# Altium schematic sheet testboard_chip1.SchDoc
size E
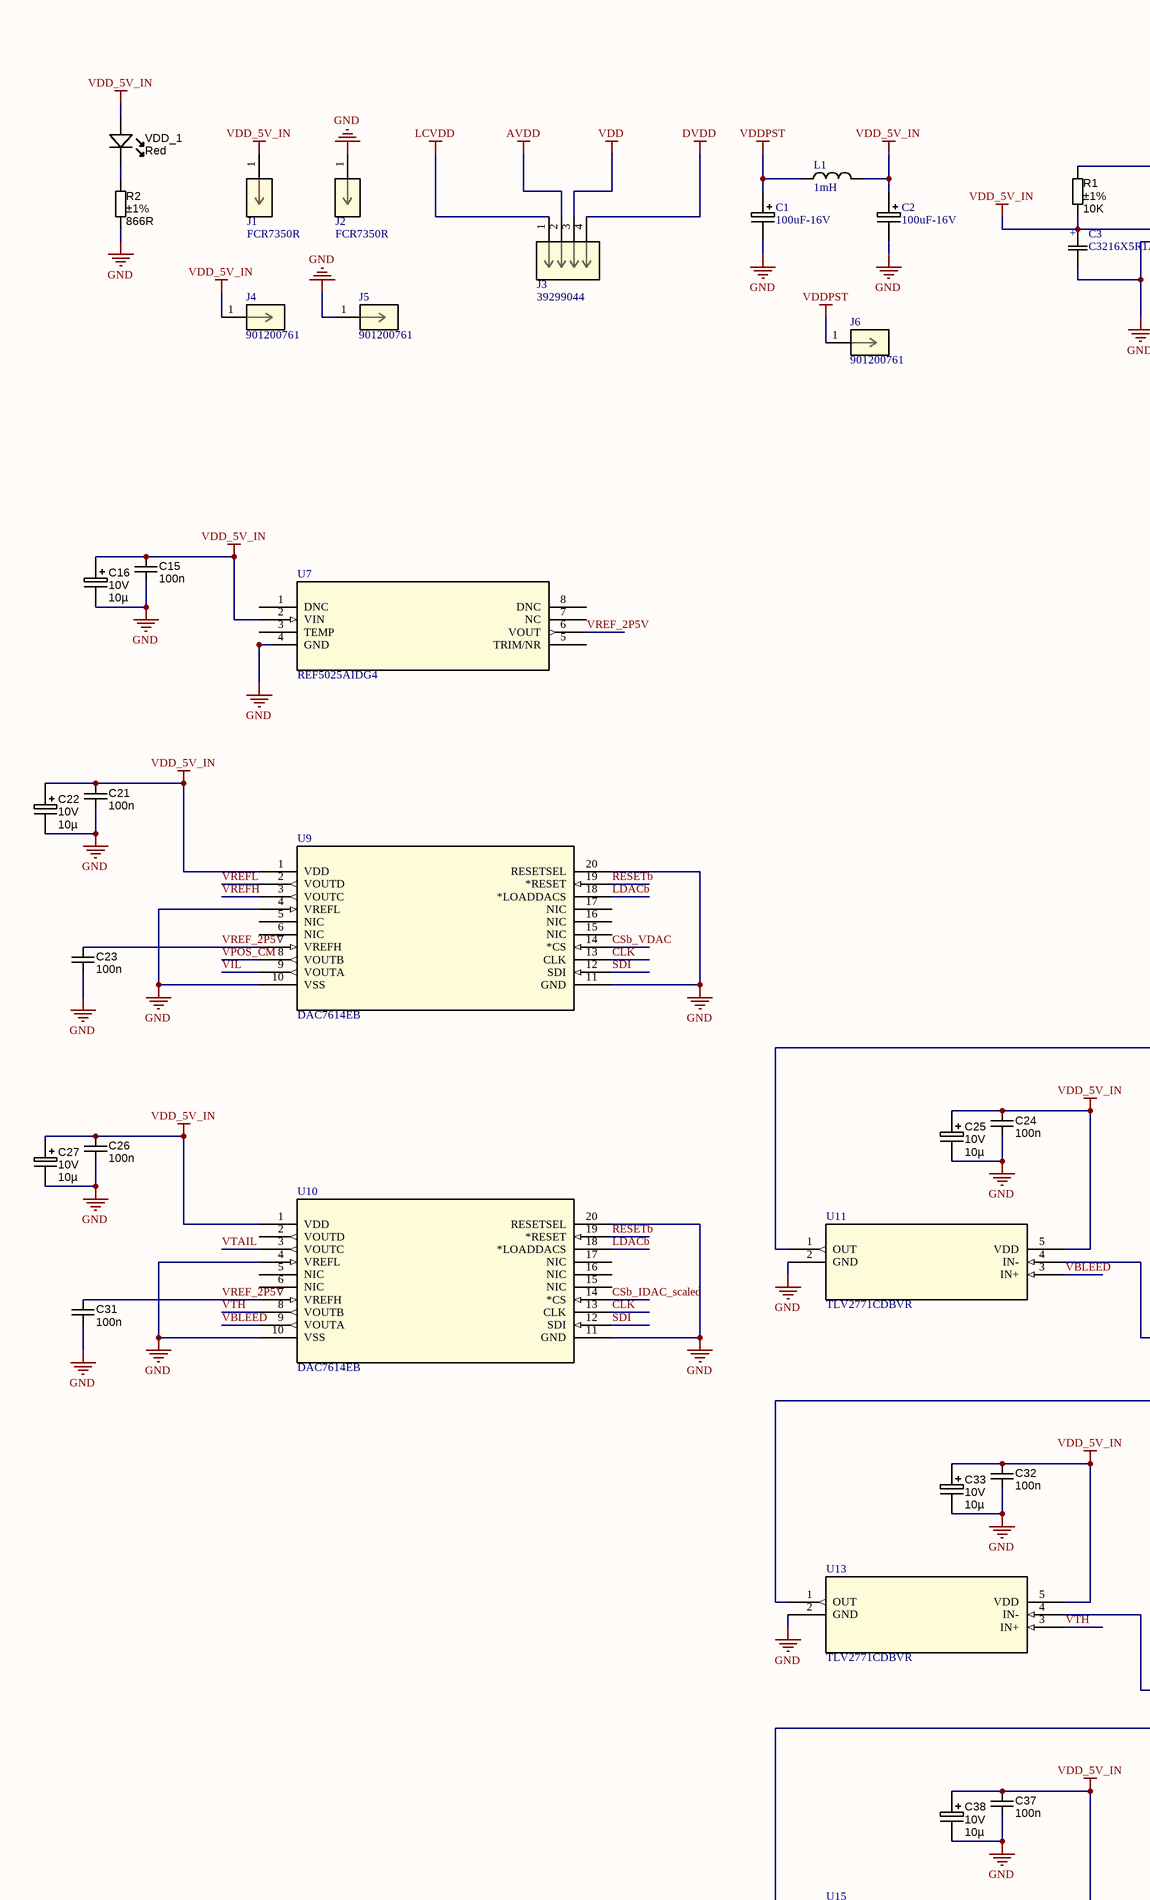
[diagram p0: testboard_chip1.SchDoc, top left]
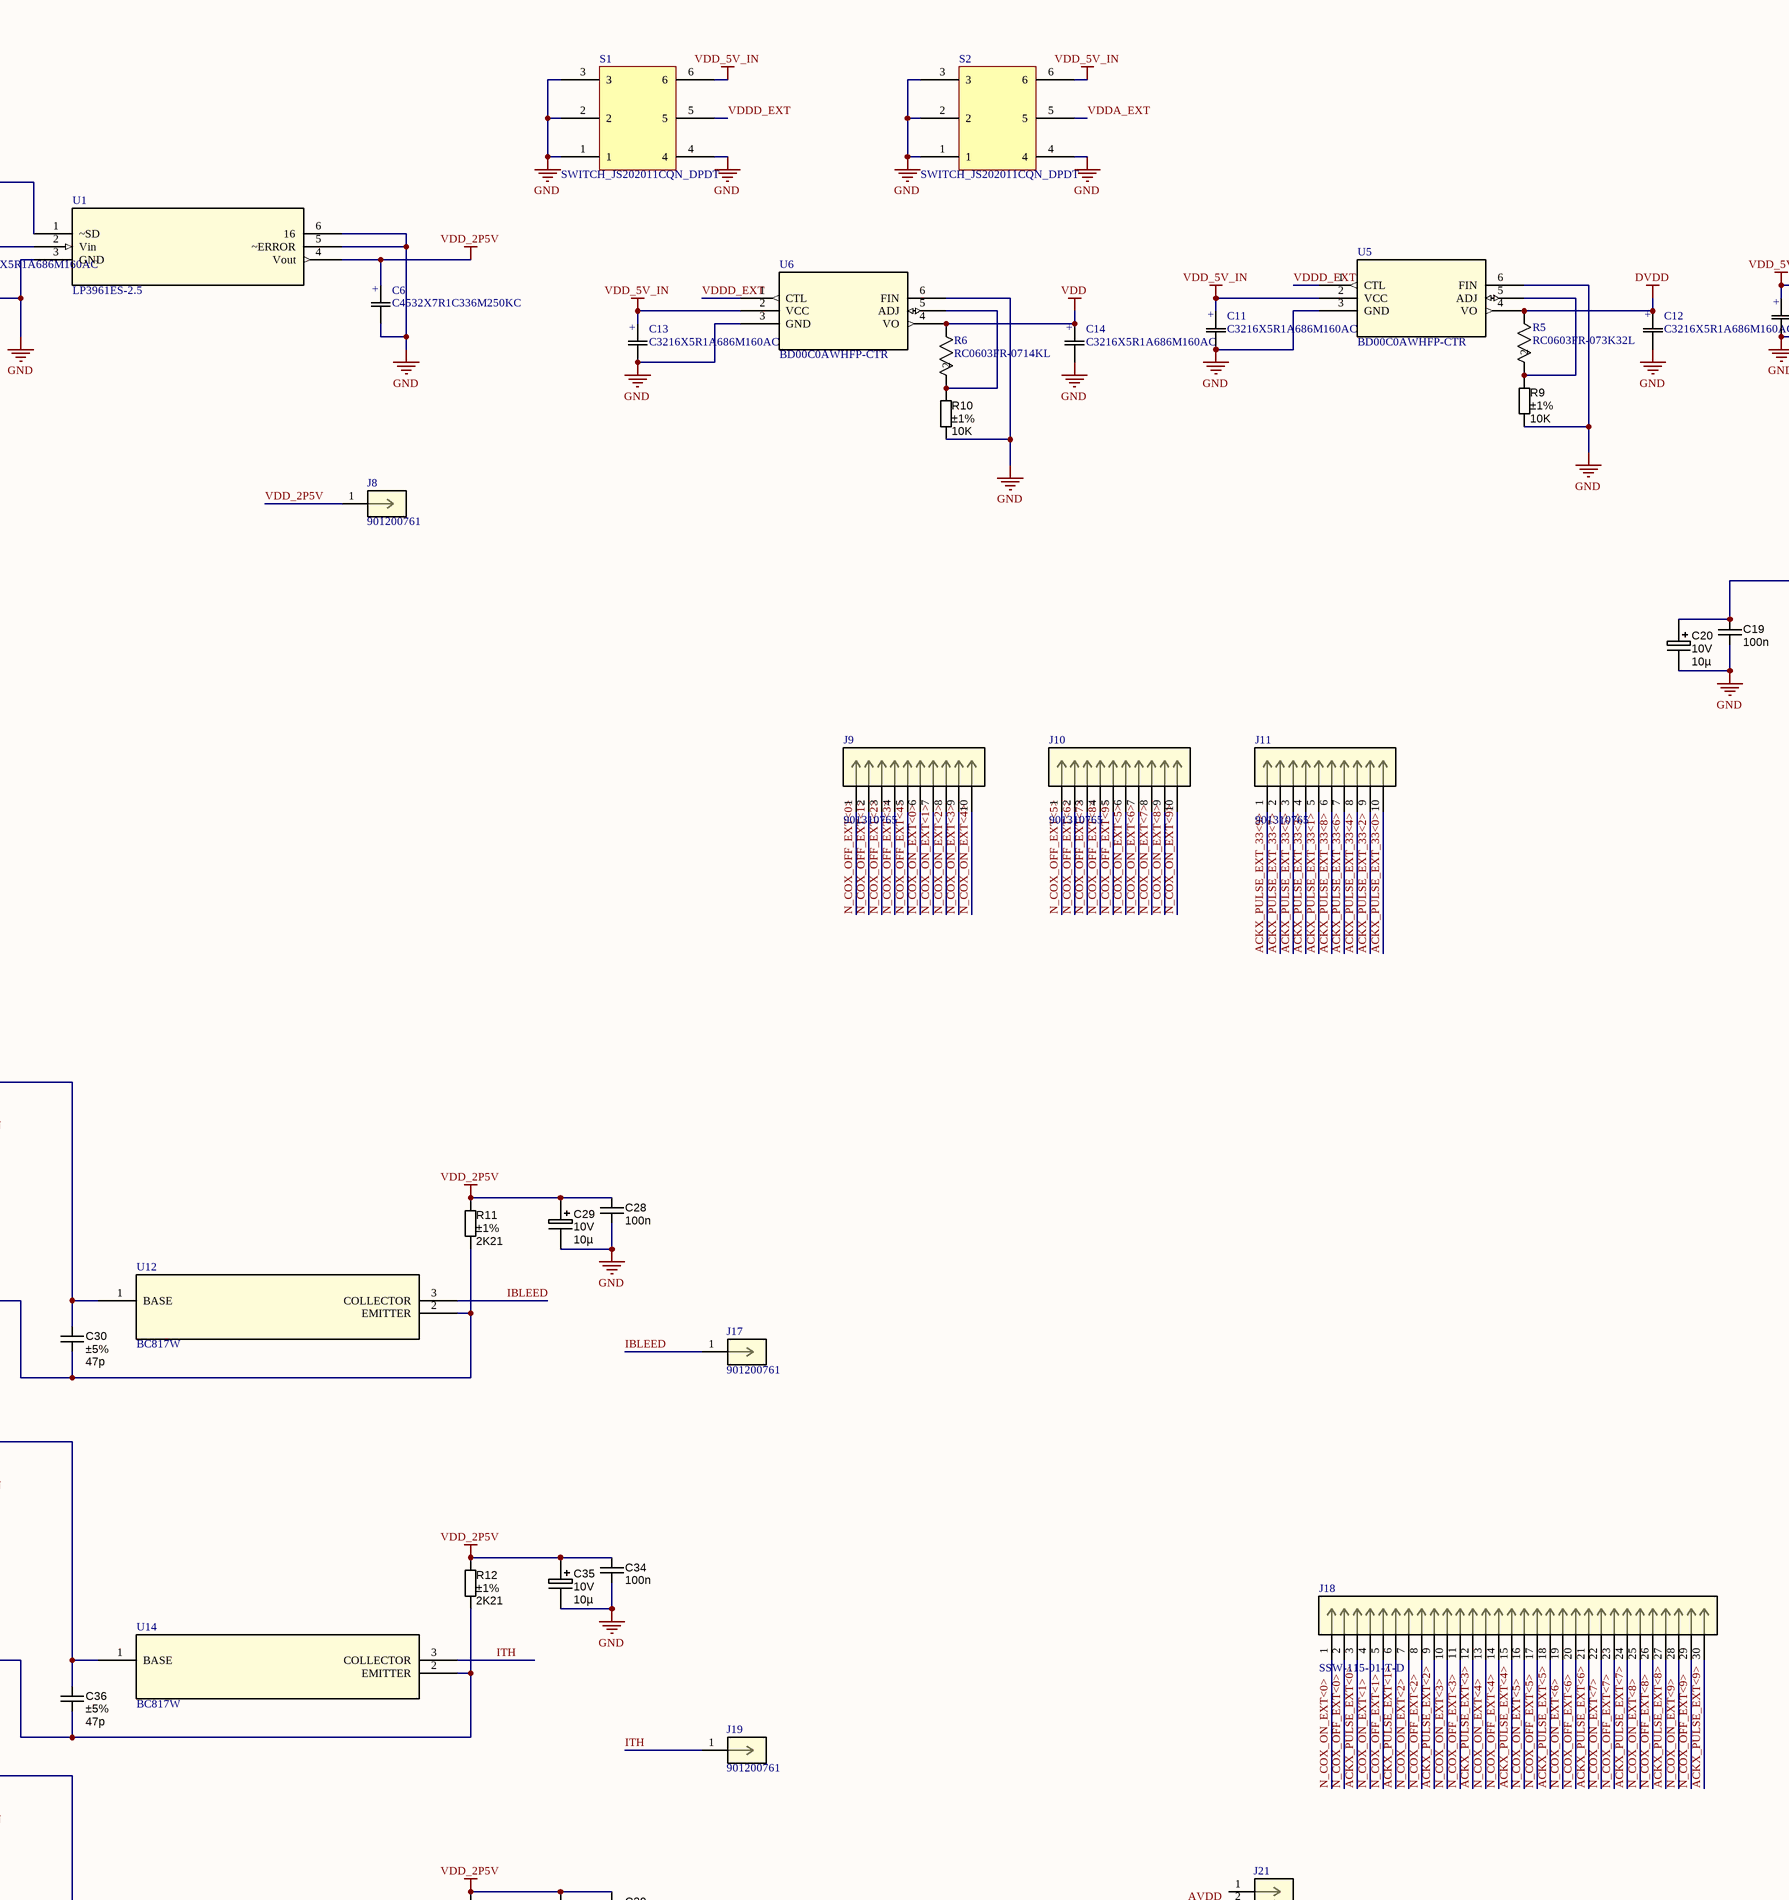
[diagram p1: testboard_chip1.SchDoc, top middle]
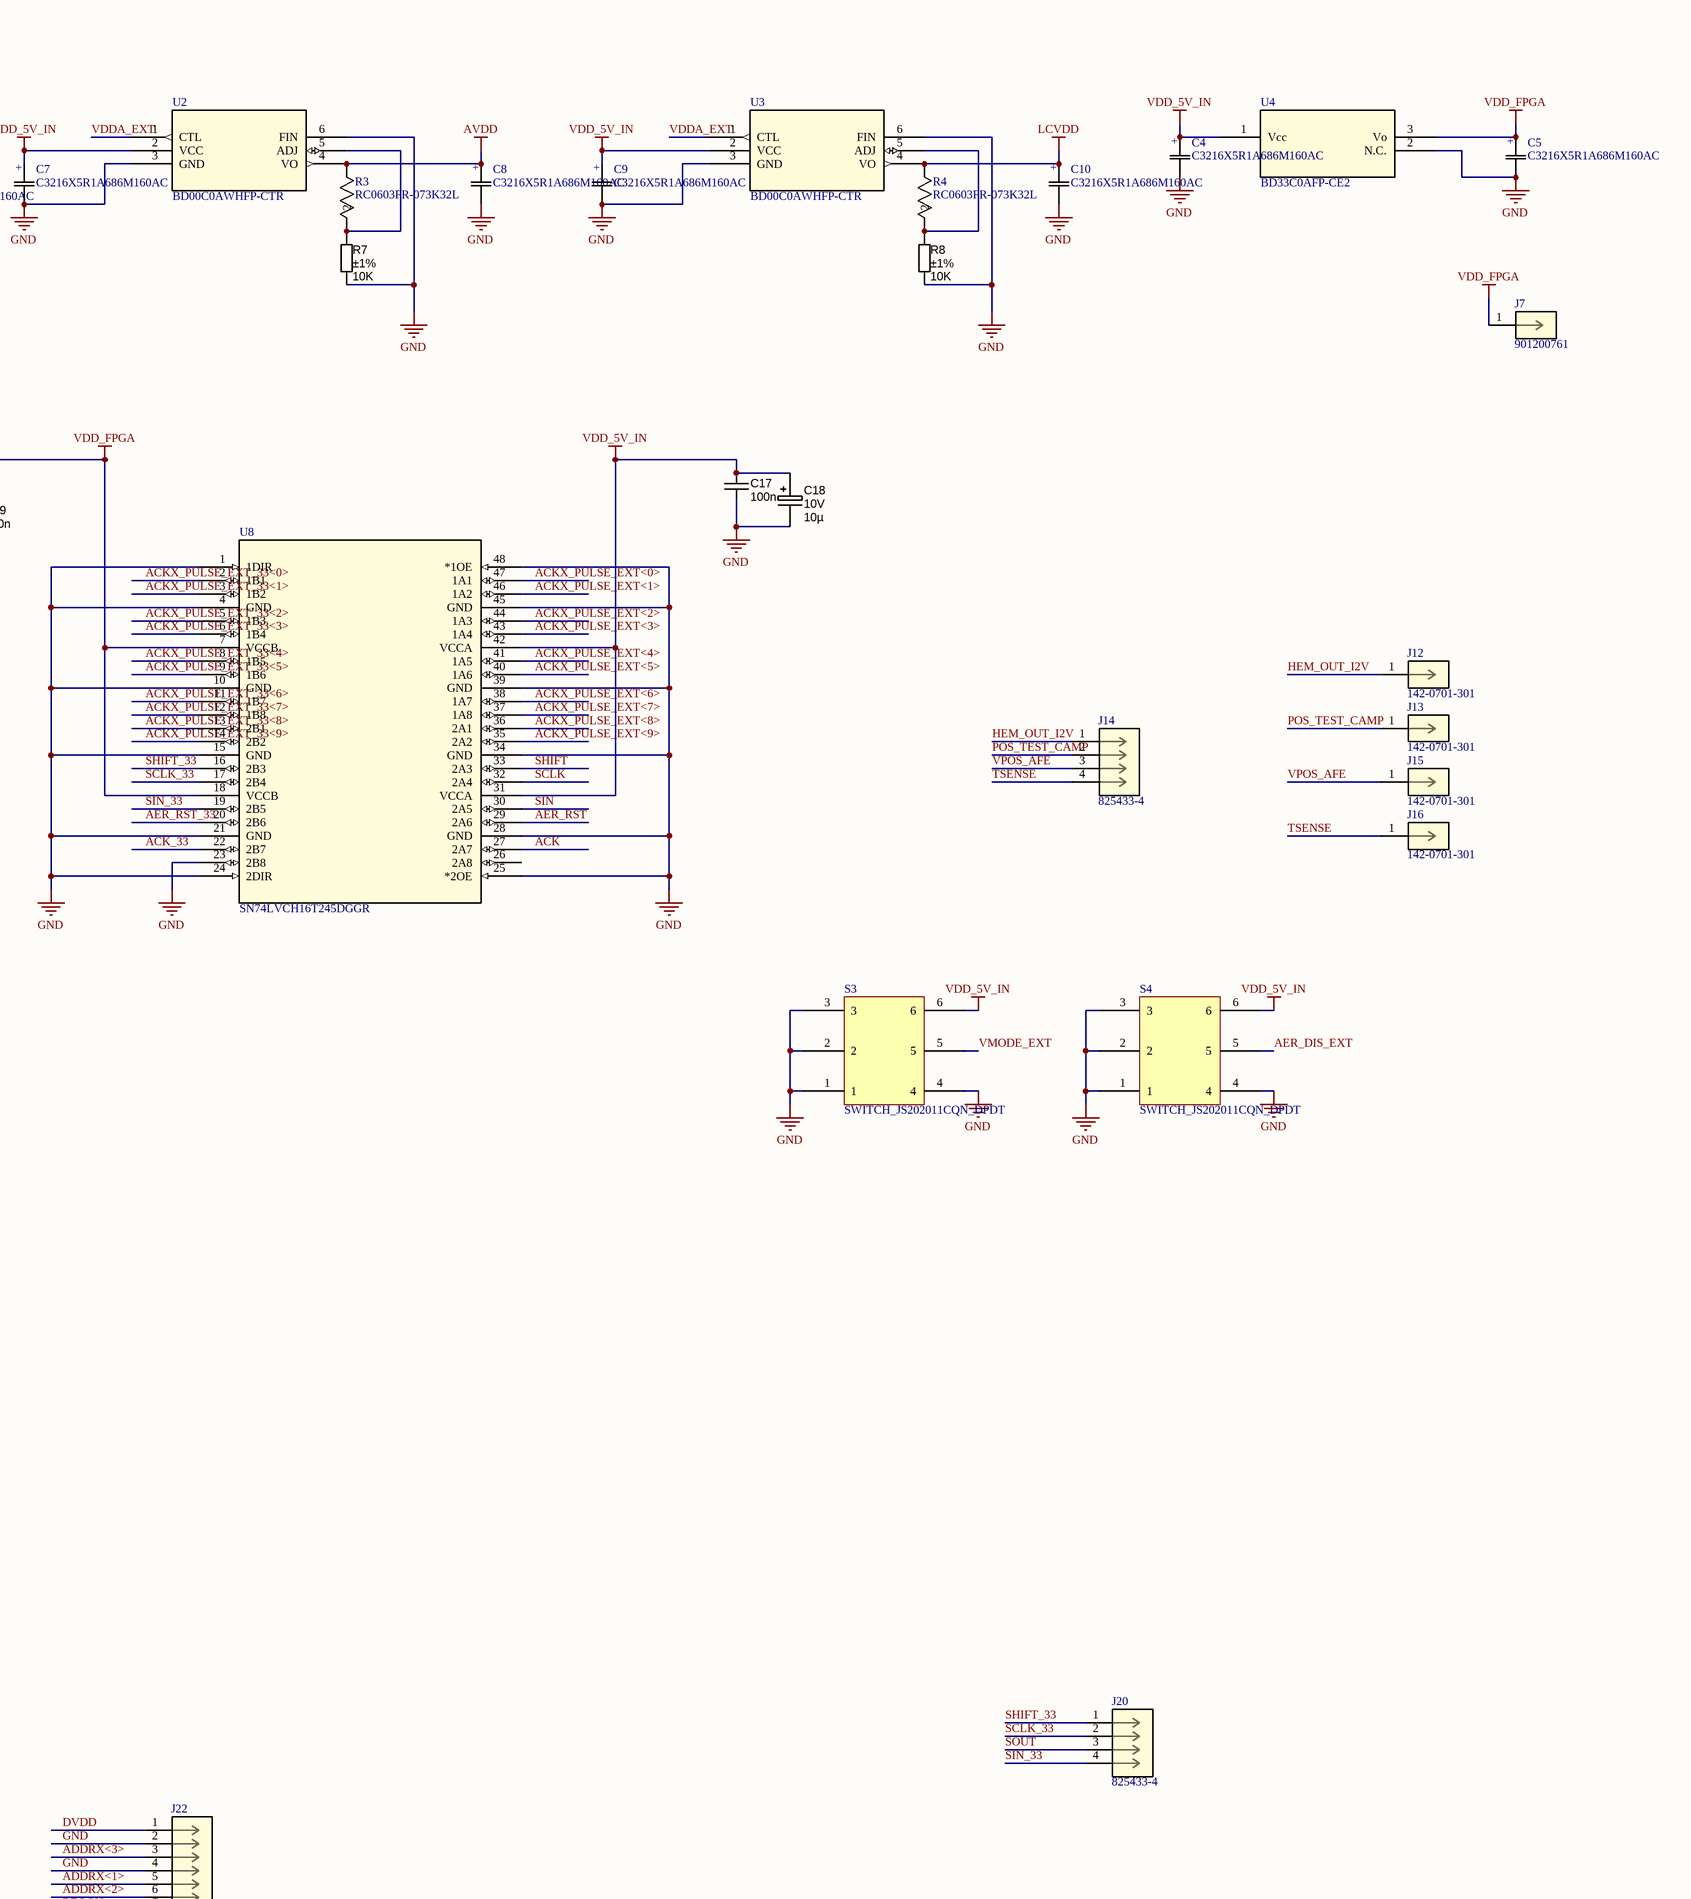
[diagram p2: testboard_chip1.SchDoc, top right]
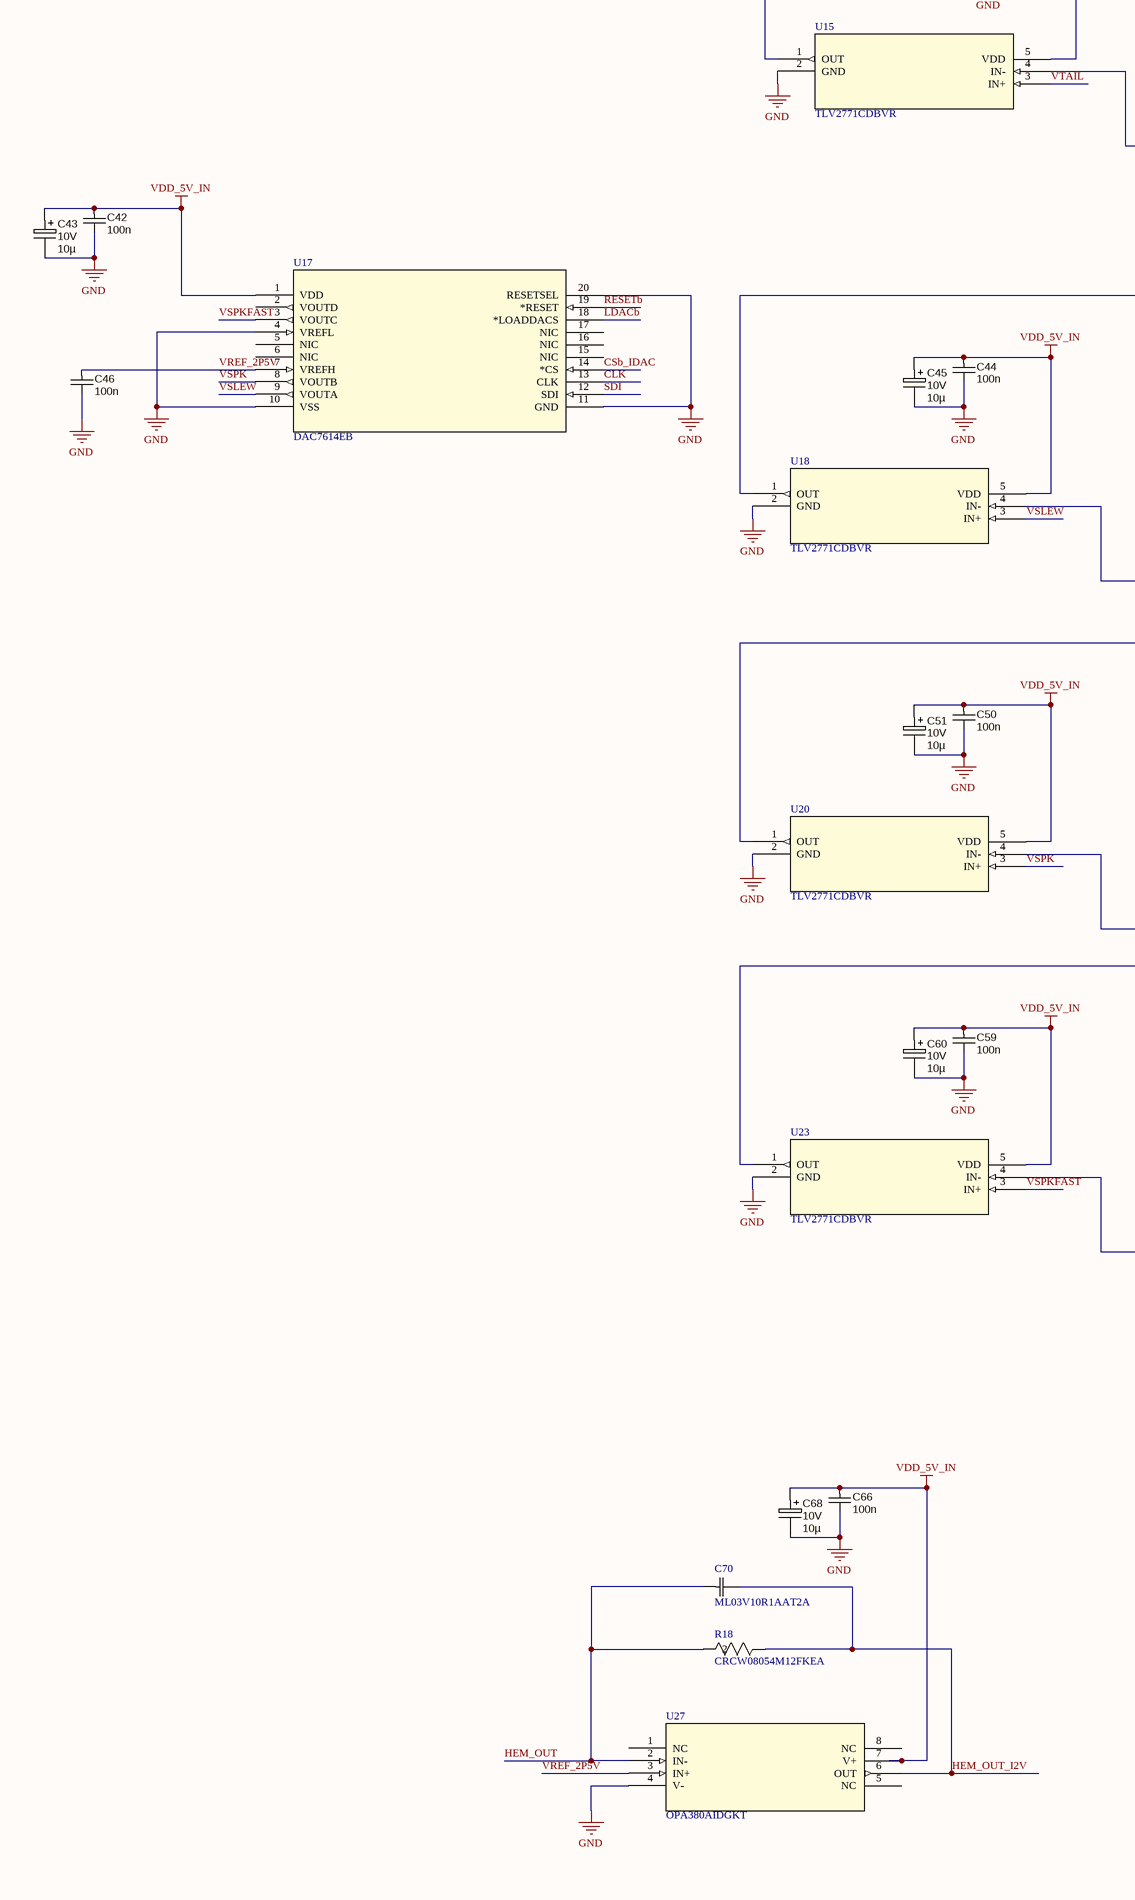
[diagram p3: testboard_chip1.SchDoc, bottom left]
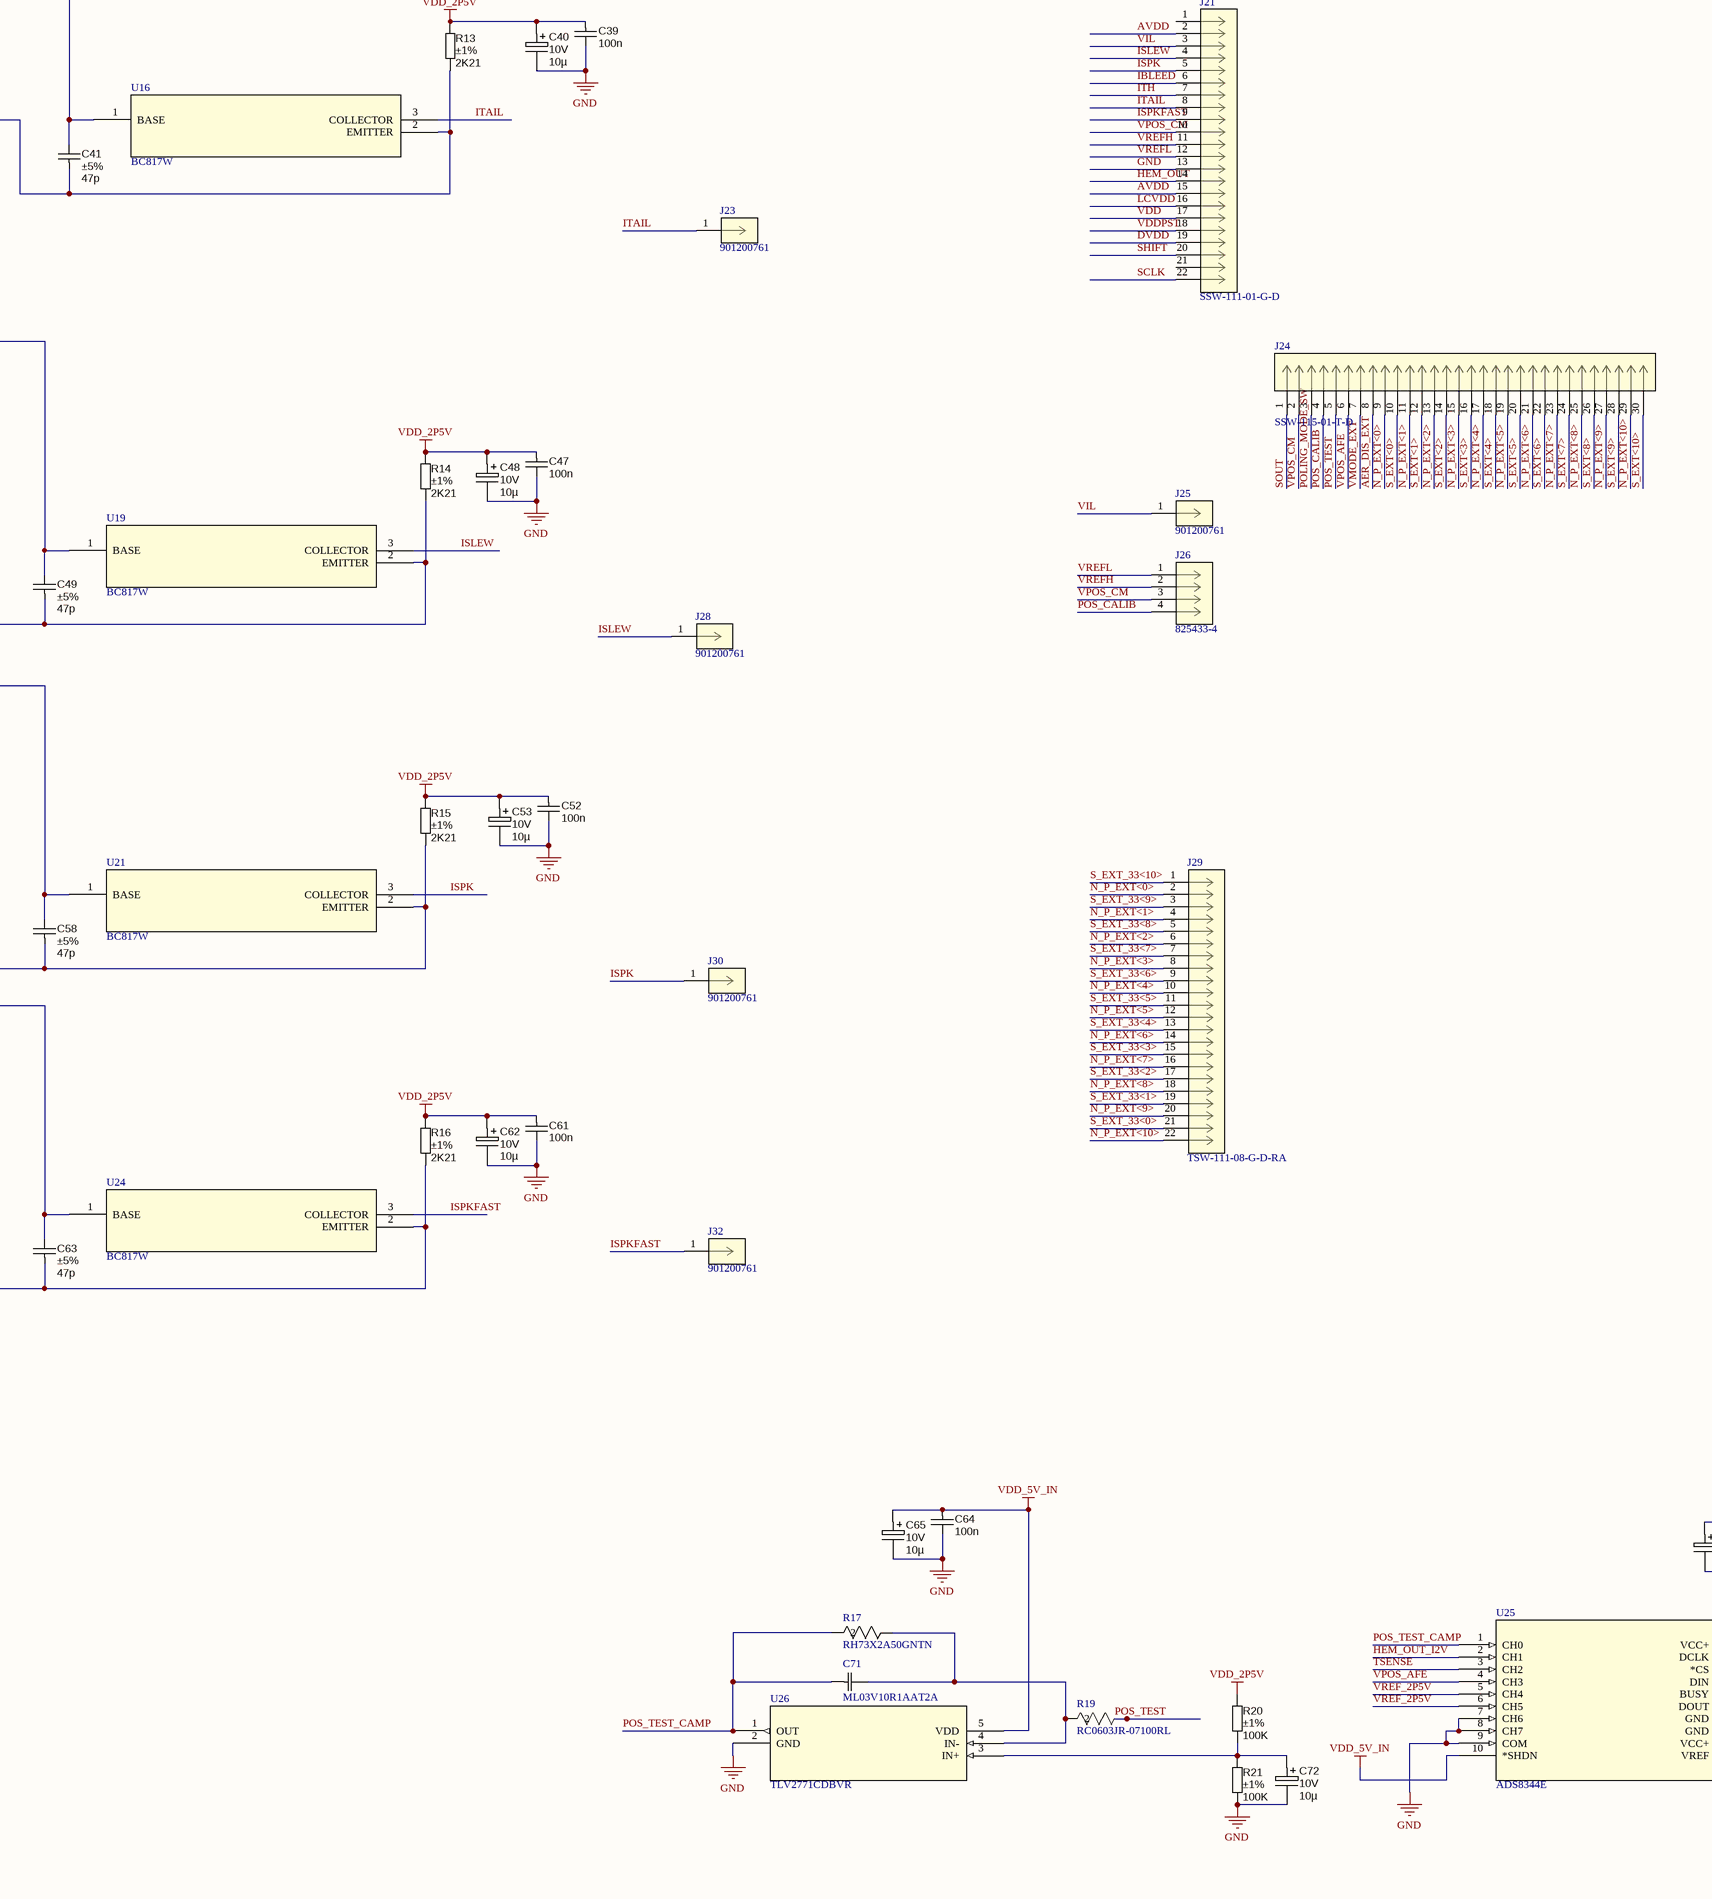
[diagram p4: testboard_chip1.SchDoc, bottom middle]
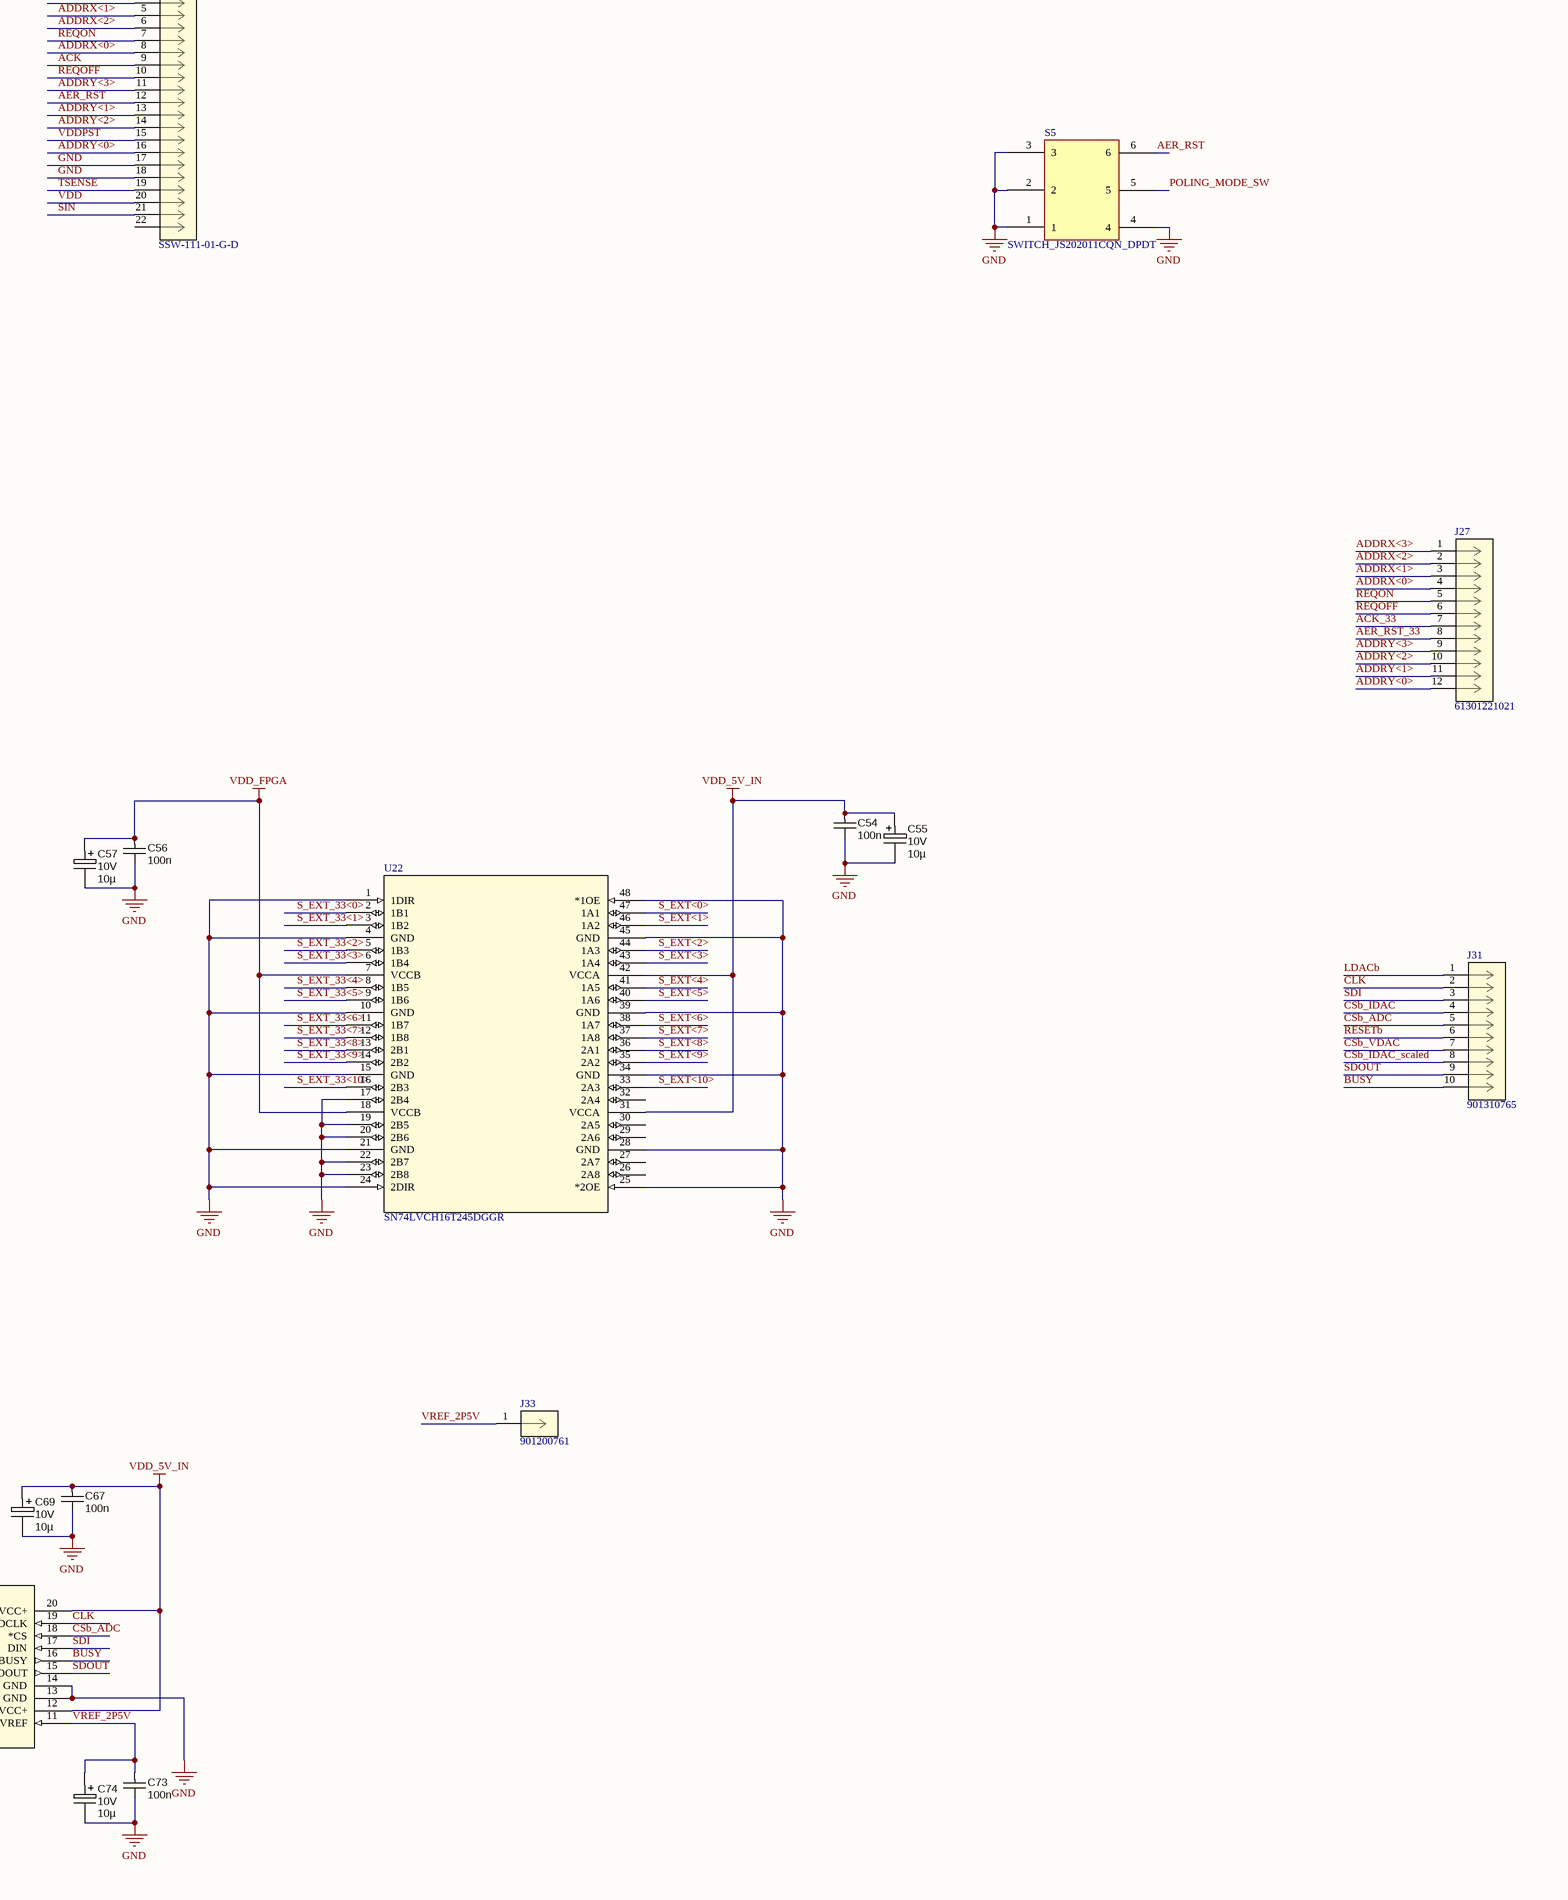
[diagram p5: testboard_chip1.SchDoc, bottom right]

## Parts
C1  100uF-16V  [PANACAP-D-GENERIC]
C2  100uF-16V  [PANACAP-D-GENERIC]
C3  C3216X5R1A686M160AC  [CAP_3216_TDK]
C4  C3216X5R1A686M160AC  [CAP_3216_TDK]
C5  C3216X5R1A686M160AC  [CAP_3216_TDK]
C6  C4532X7R1C336M250KC  [CAP_4532_TDK]
C7  C3216X5R1A686M160AC  [CAP_3216_TDK]
C8  C3216X5R1A686M160AC  [CAP_3216_TDK]
C9  C3216X5R1A686M160AC  [CAP_3216_TDK]
C10  C3216X5R1A686M160AC  [CAP_3216_TDK]
C11  C3216X5R1A686M160AC  [CAP_3216_TDK]
C12  C3216X5R1A686M160AC  [CAP_3216_TDK]
C13  C3216X5R1A686M160AC  [CAP_3216_TDK]
C14  C3216X5R1A686M160AC  [CAP_3216_TDK]
C15  value 100n  [CAPC1608N]  (hidden comment: approved sub OK)
C16  Ratings: 10V  [CAPMP2012X150USR]  (hidden comment: 10µ)
C17  value 100n  [CAPC1608N]  (hidden comment: approved sub OK)
C18  Ratings: 10V  [CAPMP2012X150USR]  (hidden comment: 10µ)
C19  value 100n  [CAPC1608N]  (hidden comment: approved sub OK)
C20  Ratings: 10V  [CAPMP2012X150USR]  (hidden comment: 10µ)
C21  value 100n  [CAPC1608N]  (hidden comment: approved sub OK)
C22  Ratings: 10V  [CAPMP2012X150USR]  (hidden comment: 10µ)
C23  value 100n  [CAPC1608N]  (hidden comment: approved sub OK)
C24  value 100n  [CAPC1608N]  (hidden comment: approved sub OK)
C25  Ratings: 10V  [CAPMP2012X150USR]  (hidden comment: 10µ)
C26  value 100n  [CAPC1608N]  (hidden comment: approved sub OK)
C27  Ratings: 10V  [CAPMP2012X150USR]  (hidden comment: 10µ)
C28  value 100n  [CAPC1608N]  (hidden comment: approved sub OK)
C29  Ratings: 10V  [CAPMP2012X150USR]  (hidden comment: 10µ)
C30  Tolerance: ±5%  [CAPC1608N]  (hidden comment: 47p)
C31  value 100n  [CAPC1608N]  (hidden comment: approved sub OK)
C32  value 100n  [CAPC1608N]  (hidden comment: approved sub OK)
C33  Ratings: 10V  [CAPMP2012X150USR]  (hidden comment: 10µ)
C34  value 100n  [CAPC1608N]  (hidden comment: approved sub OK)
C35  Ratings: 10V  [CAPMP2012X150USR]  (hidden comment: 10µ)
C36  Tolerance: ±5%  [CAPC1608N]  (hidden comment: 47p)
C37  value 100n  [CAPC1608N]  (hidden comment: approved sub OK)
C38  Ratings: 10V  [CAPMP2012X150USR]  (hidden comment: 10µ)
C39  value 100n  [CAPC1608N]  (hidden comment: approved sub OK)
C40  Ratings: 10V  [CAPMP2012X150USR]  (hidden comment: 10µ)
C41  Tolerance: ±5%  [CAPC1608N]  (hidden comment: 47p)
C42  value 100n  [CAPC1608N]  (hidden comment: approved sub OK)
C43  Ratings: 10V  [CAPMP2012X150USR]  (hidden comment: 10µ)
C44  value 100n  [CAPC1608N]  (hidden comment: approved sub OK)
C45  Ratings: 10V  [CAPMP2012X150USR]  (hidden comment: 10µ)
C46  value 100n  [CAPC1608N]  (hidden comment: approved sub OK)
C47  value 100n  [CAPC1608N]  (hidden comment: approved sub OK)
C48  Ratings: 10V  [CAPMP2012X150USR]  (hidden comment: 10µ)
C49  Tolerance: ±5%  [CAPC1608N]  (hidden comment: 47p)
C50  value 100n  [CAPC1608N]  (hidden comment: approved sub OK)
C51  Ratings: 10V  [CAPMP2012X150USR]  (hidden comment: 10µ)
C52  value 100n  [CAPC1608N]  (hidden comment: approved sub OK)
C53  Ratings: 10V  [CAPMP2012X150USR]  (hidden comment: 10µ)
C54  value 100n  [CAPC1608N]  (hidden comment: approved sub OK)
C55  Ratings: 10V  [CAPMP2012X150USR]  (hidden comment: 10µ)
C56  value 100n  [CAPC1608N]  (hidden comment: approved sub OK)
C57  Ratings: 10V  [CAPMP2012X150USR]  (hidden comment: 10µ)
C58  Tolerance: ±5%  [CAPC1608N]  (hidden comment: 47p)
C59  value 100n  [CAPC1608N]  (hidden comment: approved sub OK)
C60  Ratings: 10V  [CAPMP2012X150USR]  (hidden comment: 10µ)
C61  value 100n  [CAPC1608N]  (hidden comment: approved sub OK)
C62  Ratings: 10V  [CAPMP2012X150USR]  (hidden comment: 10µ)
C63  Tolerance: ±5%  [CAPC1608N]  (hidden comment: 47p)
C64  value 100n  [CAPC1608N]  (hidden comment: approved sub OK)
C65  Ratings: 10V  [CAPMP2012X150USR]  (hidden comment: 10µ)
C66  value 100n  [CAPC1608N]  (hidden comment: approved sub OK)
C67  value 100n  [CAPC1608N]  (hidden comment: approved sub OK)
C68  Ratings: 10V  [CAPMP2012X150USR]  (hidden comment: 10µ)
C69  Ratings: 10V  [CAPMP2012X150USR]  (hidden comment: 10µ)
C70  ML03V10R1AAT2A  [CAP_0603_AVX]
C71  ML03V10R1AAT2A  [CAP_0603_AVX]
C72  Ratings: 10V  [CAPMP2012X150USR]  (hidden comment: 10µ)
C73  value 100n  [CAPC1608N]  (hidden comment: approved sub OK)
C74  Ratings: 10V  [CAPMP2012X150USR]  (hidden comment: 10µ)
J1  FCR7350R  [CONN1_FCR7350R_CLF]
J2  FCR7350R  [CONN1_FCR7350R_CLF]
J3  39299044  [CON_39299044]
J4  901200761  [CONN_90120-0761_MOL]
J5  901200761  [CONN_90120-0761_MOL]
J6  901200761  [CONN_90120-0761_MOL]
J7  901200761  [CONN_90120-0761_MOL]
J8  901200761  [CONN_90120-0761_MOL]
J9  901310765  [CONN_901310765_MOL]
J10  901310765  [CONN_901310765_MOL]
J11  901310765  [CONN_901310765_MOL]
J12  142-0701-301  [CONN_142-0701-301_CIN]
J13  142-0701-301  [CONN_142-0701-301_CIN]
J14  825433-4  [CON4_1X4_P100UM_HDR2_TYC]
J15  142-0701-301  [CONN_142-0701-301_CIN]
J16  142-0701-301  [CONN_142-0701-301_CIN]
J17  901200761  [CONN_90120-0761_MOL]
J18  SSW-115-01-T-D  [CON30_2X15_TU_SSQ]
J19  901200761  [CONN_90120-0761_MOL]
J20  825433-4  [CON4_1X4_P100UM_HDR2_TYC]
J21  SSW-111-01-G-D  [CON23_2X11_TU_SSQ]
J22  SSW-111-01-G-D  [CON23_2X11_TU_SSQ]
J23  901200761  [CONN_90120-0761_MOL]
J24  SSW-115-01-T-D  [CON30_2X15_TU_SSQ]
J25  901200761  [CONN_90120-0761_MOL]
J26  825433-4  [CON4_1X4_P100UM_HDR2_TYC]
J27  61301221021  [CONN_61301221021_WRE]
J28  901200761  [CONN_90120-0761_MOL]
J29  TSW-111-08-G-D-RA  [CON23_2X11_TR_TSW_SAI]
J30  901200761  [CONN_90120-0761_MOL]
J31  901310765  [CONN_901310765_MOL]
J32  901200761  [CONN_90120-0761_MOL]
J33  901200761  [CONN_90120-0761_MOL]
L1  1mH  [MCSDRB7032-102MHF]
R1  value 10K  Tolerance: ±1%  [RESC1608N]  (hidden comment: Thick Film)
R2  value 866R  Tolerance: ±1%  [RESC1608N]  (hidden comment: Thick Film)
R3  RC0603FR-073K32L  [RC0603N_YAG]
R4  RC0603FR-073K32L  [RC0603N_YAG]
R5  RC0603FR-073K32L  [RC0603N_YAG]
R6  RC0603FR-0714KL  [RC0603N_YAG]
R7  value 10K  Tolerance: ±1%  [RESC1608N]  (hidden comment: Thick Film)
R8  value 10K  Tolerance: ±1%  [RESC1608N]  (hidden comment: Thick Film)
R9  value 10K  Tolerance: ±1%  [RESC1608N]  (hidden comment: Thick Film)
R10  value 10K  Tolerance: ±1%  [RESC1608N]  (hidden comment: Thick Film)
R11  value 2K21  Tolerance: ±1%  [RESC1608N]  (hidden comment: Thick Film)
R12  value 2K21  Tolerance: ±1%  [RESC1608N]  (hidden comment: Thick Film)
R13  value 2K21  Tolerance: ±1%  [RESC1608N]  (hidden comment: Thick Film)
R14  value 2K21  Tolerance: ±1%  [RESC1608N]  (hidden comment: Thick Film)
R15  value 2K21  Tolerance: ±1%  [RESC1608N]  (hidden comment: Thick Film)
R16  value 2K21  Tolerance: ±1%  [RESC1608N]  (hidden comment: Thick Film)
R17  RH73X2A50GNTN  [RES_RH732A_TYC]
R18  CRCW08054M12FKEA  [RC0805N_VIS]
R19  RC0603JR-07100RL  [RC0603N_YAG]
R20  value 100K  Tolerance: ±1%  [RESC1608N]  (hidden comment: Thick Film)
R21  value 100K  Tolerance: ±1%  [RESC1608N]  (hidden comment: Thick Film)
S1  SWITCH_JS202011CQN_DPDT  [PCBComponent_1]
S2  SWITCH_JS202011CQN_DPDT  [PCBComponent_1]
S3  SWITCH_JS202011CQN_DPDT  [PCBComponent_1]
S4  SWITCH_JS202011CQN_DPDT  [PCBComponent_1]
S5  SWITCH_JS202011CQN_DPDT  [PCBComponent_1]
U1  LP3961ES-2.5  [TS5B_TEX]
U2  BD00C0AWHFP-CTR  [HRP5_BD00C0_ROM]
U3  BD00C0AWHFP-CTR  [HRP5_BD00C0_ROM]
U4  BD33C0AFP-CE2  [TO252-3_ROM]
U5  BD00C0AWHFP-CTR  [HRP5_BD00C0_ROM]
U6  BD00C0AWHFP-CTR  [HRP5_BD00C0_ROM]
U7  REF5025AIDG4  [D8]
U8  SN74LVCH16T245DGGR  [DGG48]
U9  DAC7614EB  [DB20]
U10  DAC7614EB  [DB20]
U11  TLV2771CDBVR  [DBV5]
U12  BC817W  [SOT323_NEX]
U13  TLV2771CDBVR  [DBV5]
U14  BC817W  [SOT323_NEX]
U15  TLV2771CDBVR  [DBV5]
U16  BC817W  [SOT323_NEX]
U17  DAC7614EB  [DB20]
U18  TLV2771CDBVR  [DBV5]
U19  BC817W  [SOT323_NEX]
U20  TLV2771CDBVR  [DBV5]
U21  BC817W  [SOT323_NEX]
U22  SN74LVCH16T245DGGR  [DGG48]
U23  TLV2771CDBVR  [DBV5]
U24  BC817W  [SOT323_NEX]
U25  ADS8344E  [DBQ20]
U26  TLV2771CDBVR  [DBV5]
U27  OPA380AIDGKT  [DGK8]
VDD_1  Red  [LED-0603-RED]

## Nets
AVDD: C8.1 J3.2 J21.2 J21.15 R3.1 U2.4(VO)
DVDD: C12.1 J3.4 J21.19 J22.1 R5.1 U5.4(VO)
GND: C1.- C2.- C3.2 C4.2 C5.2 C6.2 C7.2 C8.2 C9.2 C10.2 C11.2 C12.2 C13.2 C14.2 C15.2 C16.2 C17.2 C18.2 C19.2 C20.2 C21.2 C22.2 C23.2 C24.2 C25.2 C26.2 C27.2 C28.2 C29.2 C31.2 C32.2 C33.2 C34.2 C35.2 C37.2 C38.2 C39.2 C40.2 C42.2 C43.2 C44.2 C45.2 C46.2 C47.2 C48.2 C50.2 C51.2 C52.2 C53.2 C54.2 C55.2 C56.2 C57.2 C59.2 C60.2 C61.2 C62.2 C64.2 C65.2 C66.2 C67.2 C68.2 C69.2 C72.2 C73.2 C74.2 J2.1 J5.1 J21.13 J22.2 J22.4 J22.17 J22.18 R2.2 R7.2 R8.2 R9.2 R10.2 R21.2 S1.1 S1.2 S1.3 S1.4 S2.1 S2.2 S2.3 S2.4 S3.1 S3.2 S3.3 S3.4 S4.1 S4.2 S4.3 S4.4 S5.1 S5.2 S5.3 S5.4 U1.3(GND) U1.5(~ERROR) U1.6(16) U2.3(GND) U2.6(FIN) U3.3(GND) U3.6(FIN) U4.2(N.C.) U5.3(GND) U5.6(FIN) U6.3(GND) U6.6(FIN) U7.4(GND) U8.1(1DIR) U8.4(GND) U8.10(GND) U8.15(GND) U8.21(GND) U8.23(2B8) U8.24(2DIR) U8.25(*2OE) U8.28(GND) U8.34(GND) U8.39(GND) U8.45(GND) U8.48(*1OE) U9.4(VREFL) U9.10(VSS) U9.11(GND) U9.20(RESETSEL) U10.4(VREFL) U10.10(VSS) U10.11(GND) U10.20(RESETSEL) U11.2(GND) U13.2(GND) U15.2(GND) U17.4(VREFL) U17.10(VSS) U17.11(GND) U17.20(RESETSEL) U18.2(GND) U20.2(GND) U22.1(1DIR) U22.4(GND) U22.10(GND) U22.15(GND) U22.17(2B4) U22.19(2B5) U22.20(2B6) U22.21(GND) U22.22(2B7) U22.23(2B8) U22.24(2DIR) U22.25(*2OE) U22.28(GND) U22.34(GND) U22.39(GND) U22.45(GND) U22.48(*1OE) U23.2(GND) U25.7(CH6) U25.8(CH7) U25.9(COM) U25.13(GND) U25.14(GND) U26.2(GND) U27.4(V-)
LCVDD: C10.1 J3.1 J21.16 R4.1 U3.4(VO)
VDD: C14.1 J3.3 J21.17 J22.20 R6.1 U6.4(VO)
VDD_2P5V: C6.1 C28.1 C29.1 C34.1 C35.1 C39.1 C40.1 C47.1 C48.1 C52.1 C53.1 C61.1 C62.1 J8.1 R11.1 R12.1 R13.1 R14.1 R15.1 R16.1 R20.1 U1.4(Vout)
VDD_5V_IN: C2.+ C3.1 C4.1 C7.1 C9.1 C11.1 C13.1 C15.1 C16.1 C17.1 C18.1 C21.1 C22.1 C24.1 C25.1 C26.1 C27.1 C32.1 C33.1 C37.1 C38.1 C42.1 C43.1 C44.1 C45.1 C50.1 C51.1 C54.1 C55.1 C59.1 C60.1 C64.1 C65.1 C66.1 C67.1 C68.1 C69.1 J1.1 J4.1 L1.2 R1.2 S1.6 S2.6 S3.6 S4.6 U1.2(Vin) U2.2(VCC) U3.2(VCC) U4.1(Vcc) U5.2(VCC) U6.2(VCC) U7.2(VIN) U8.31(VCCA) U8.42(VCCA) U9.1(VDD) U10.1(VDD) U11.5(VDD) U13.5(VDD) U15.5(VDD) U17.1(VDD) U18.5(VDD) U20.5(VDD) U22.31(VCCA) U22.42(VCCA) U23.5(VDD) U25.10(*SHDN) U25.12(VCC+) U25.20(VCC+) U26.5(VDD) U27.7(V+) VDD_1.A
VDD_FPGA: C5.1 C19.1 C20.1 C56.1 C57.1 J7.1 U4.3(Vo) U8.7(VCCB) U8.18(VCCB) U22.7(VCCB) U22.18(VCCB)
VDDPST: C1.+ J6.1 J21.18 J22.15 L1.1
ACK: J22.9 U8.27(2A7)
ACK_33: J27.7 U8.22(2B7)
ACKX_PULSE_EXT<0>: J18.3 U8.47(1A1)
ACKX_PULSE_EXT<1>: J18.6 U8.46(1A2)
ACKX_PULSE_EXT<2>: J18.9 U8.44(1A3)
ACKX_PULSE_EXT<3>: J18.12 U8.43(1A4)
ACKX_PULSE_EXT<4>: J18.15 U8.41(1A5)
ACKX_PULSE_EXT<5>: J18.18 U8.40(1A6)
ACKX_PULSE_EXT<6>: J18.21 U8.38(1A7)
ACKX_PULSE_EXT<7>: J18.24 U8.37(1A8)
ACKX_PULSE_EXT<8>: J18.27 U8.36(2A1)
ACKX_PULSE_EXT<9>: J18.30 U8.35(2A2)
ACKX_PULSE_EXT_33<0>: J11.10 U8.2(1B1)
ACKX_PULSE_EXT_33<1>: J11.5 U8.3(1B2)
ACKX_PULSE_EXT_33<2>: J11.9 U8.5(1B3)
ACKX_PULSE_EXT_33<3>: J11.4 U8.6(1B4)
ACKX_PULSE_EXT_33<4>: J11.8 U8.8(1B5)
ACKX_PULSE_EXT_33<5>: J11.3 U8.9(1B6)
ACKX_PULSE_EXT_33<6>: J11.7 U8.11(1B7)
ACKX_PULSE_EXT_33<7>: J11.2 U8.12(1B8)
ACKX_PULSE_EXT_33<8>: J11.6 U8.13(2B1)
ACKX_PULSE_EXT_33<9>: J11.1 U8.14(2B2)
ADDRX<0>: J22.8 J27.4
ADDRX<1>: J22.5 J27.3
ADDRX<2>: J22.6 J27.2
ADDRX<3>: J22.3 J27.1
ADDRY<0>: J22.16 J27.12
ADDRY<1>: J22.13 J27.11
ADDRY<2>: J22.14 J27.10
ADDRY<3>: J22.11 J27.9
AER_DIS_EXT: J24.8 S4.5
AER_RST: J22.12 S5.6 U8.29(2A6)
AER_RST_33: J27.8 U8.20(2B6)
BUSY: J31.10 U25.16(BUSY)
CLK: J31.2 U9.13(CLK) U10.13(CLK) U17.13(CLK) U25.19(DCLK)
CSb_ADC: J31.5 U25.18(*CS)
CSb_IDAC: J31.4 U17.14(*CS)
CSb_IDAC_scaled: J31.8 U10.14(*CS)
CSb_VDAC: J31.7 U9.14(*CS)
HEM_OUT: C70.1 J21.14 R18.2 U27.2(IN-)
HEM_OUT_I2V: C70.2 J12.1 J14.1 R18.1 U25.2(CH1) U27.6(OUT)
IBLEED: J17.1 J21.6 U12.3(COLLECTOR)
ISLEW: J21.4 J28.1 U19.3(COLLECTOR)
ISPK: J21.5 J30.1 U21.3(COLLECTOR)
ISPKFAST: J21.9 J32.1 U24.3(COLLECTOR)
ITAIL: J21.8 J23.1 U16.3(COLLECTOR)
ITH: J19.1 J21.7 U14.3(COLLECTOR)
LDACb: J31.1 U9.18(*LOADDACS) U10.18(*LOADDACS) U17.18(*LOADDACS)
N_COX_OFF_EXT<0>: J9.1 J18.2
N_COX_OFF_EXT<1>: J9.2 J18.5
N_COX_OFF_EXT<2>: J9.3 J18.8
N_COX_OFF_EXT<3>: J9.4 J18.11
N_COX_OFF_EXT<4>: J9.5 J18.14
N_COX_OFF_EXT<5>: J10.1 J18.17
N_COX_OFF_EXT<6>: J10.2 J18.20
N_COX_OFF_EXT<7>: J10.3 J18.23
N_COX_OFF_EXT<8>: J10.4 J18.26
N_COX_OFF_EXT<9>: J10.5 J18.29
N_COX_ON_EXT<0>: J9.6 J18.1
N_COX_ON_EXT<1>: J9.7 J18.4
N_COX_ON_EXT<2>: J9.8 J18.7
N_COX_ON_EXT<3>: J9.9 J18.10
N_COX_ON_EXT<4>: J9.10 J18.13
N_COX_ON_EXT<5>: J10.6 J18.16
N_COX_ON_EXT<6>: J10.7 J18.19
N_COX_ON_EXT<7>: J10.8 J18.22
N_COX_ON_EXT<8>: J10.9 J18.25
N_COX_ON_EXT<9>: J10.10 J18.28
N_P_EXT<0>: J24.9 J29.2
N_P_EXT<1>: J24.11 J29.4
N_P_EXT<2>: J24.13 J29.6
N_P_EXT<3>: J24.15 J29.8
N_P_EXT<4>: J24.17 J29.10
N_P_EXT<5>: J24.19 J29.12
N_P_EXT<6>: J24.21 J29.14
N_P_EXT<7>: J24.23 J29.16
N_P_EXT<8>: J24.25 J29.18
N_P_EXT<9>: J24.27 J29.20
N_P_EXT<10>: J24.29 J29.22
POLING_MODE_SW: J24.3 S5.5
POS_CALIB: J24.4 J26.4
POS_TEST: J24.5 R19.1
POS_TEST_CAMP: C71.1 J13.1 J14.2 R17.2 U25.1(CH0) U26.1(OUT)
REQOFF: J22.10 J27.6
REQON: J22.7 J27.5
RESETb: J31.6 U9.19(*RESET) U10.19(*RESET) U17.19(*RESET)
S_EXT<0>: J24.10 U22.47(1A1)
S_EXT<1>: J24.12 U22.46(1A2)
S_EXT<2>: J24.14 U22.44(1A3)
S_EXT<3>: J24.16 U22.43(1A4)
S_EXT<4>: J24.18 U22.41(1A5)
S_EXT<5>: J24.20 U22.40(1A6)
S_EXT<6>: J24.22 U22.38(1A7)
S_EXT<7>: J24.24 U22.37(1A8)
S_EXT<8>: J24.26 U22.36(2A1)
S_EXT<9>: J24.28 U22.35(2A2)
S_EXT<10>: J24.30 U22.33(2A3)
S_EXT_33<0>: J29.21 U22.2(1B1)
S_EXT_33<1>: J29.19 U22.3(1B2)
S_EXT_33<2>: J29.17 U22.5(1B3)
S_EXT_33<3>: J29.15 U22.6(1B4)
S_EXT_33<4>: J29.13 U22.8(1B5)
S_EXT_33<5>: J29.11 U22.9(1B6)
S_EXT_33<6>: J29.9 U22.11(1B7)
S_EXT_33<7>: J29.7 U22.12(1B8)
S_EXT_33<8>: J29.5 U22.13(2B1)
S_EXT_33<9>: J29.3 U22.14(2B2)
S_EXT_33<10>: J29.1 U22.16(2B3)
SCLK: J21.22 U8.32(2A4)
SCLK_33: J20.2 U8.17(2B4)
SDI: J31.3 U9.12(SDI) U10.12(SDI) U17.12(SDI) U25.17(DIN)
SDOUT: J31.9 U25.15(DOUT)
SHIFT: J21.20 U8.33(2A3)
SHIFT_33: J20.1 U8.16(2B3)
SIN: J22.21 U8.30(2A5)
SIN_33: J20.4 U8.19(2B5)
SOUT: J20.3 J24.1
TSENSE: J14.4 J16.1 J22.19 U25.3(CH2)
VBLEED: U10.9(VOUTA) U11.3(IN+)
VDDA_EXT: S2.5 U2.1(CTL) U3.1(CTL)
VDDD_EXT: S1.5 U5.1(CTL) U6.1(CTL)
VIL: J21.3 J25.1 U9.9(VOUTA)
VMODE_EXT: J24.7 S3.5
VPOS_AFE: J14.3 J15.1 J24.6 U25.4(CH3)
VPOS_CM: J21.10 J24.2 J26.3 U9.8(VOUTB)
VREF_2P5V: C23.1 C31.1 C46.1 C73.1 C74.1 J33.1 U7.6(VOUT) U9.7(VREFH) U10.7(VREFH) U17.7(VREFH) U25.5(CH4) U25.6(CH5) U25.11(VREF) U27.3(IN+)
VREFH: J21.11 J26.2 U9.3(VOUTC)
VREFL: J21.12 J26.1 U9.2(VOUTD)
VSLEW: U17.9(VOUTA) U18.3(IN+)
VSPK: U17.8(VOUTB) U20.3(IN+)
VSPKFAST: U17.3(VOUTC) U23.3(IN+)
VTAIL: U10.3(VOUTC) U15.3(IN+)
VTH: U10.8(VOUTB) U13.3(IN+)
NetC30_1: C30.1 R11.2 U11.4(IN-) U12.2(EMITTER)
NetC30_2: C30.2 U11.1(OUT) U12.1(BASE)
NetC36_1: C36.1 R12.2 U13.4(IN-) U14.2(EMITTER)
NetC36_2: C36.2 U13.1(OUT) U14.1(BASE)
NetC41_1: C41.1 R13.2 U15.4(IN-) U16.2(EMITTER)
NetC41_2: C41.2 U15.1(OUT) U16.1(BASE)
NetC49_1: C49.1 R14.2 U18.4(IN-) U19.2(EMITTER)
NetC49_2: C49.2 U18.1(OUT) U19.1(BASE)
NetC58_1: C58.1 R15.2 U20.4(IN-) U21.2(EMITTER)
NetC58_2: C58.2 U20.1(OUT) U21.1(BASE)
NetC63_1: C63.1 R16.2 U23.4(IN-) U24.2(EMITTER)
NetC63_2: C63.2 U23.1(OUT) U24.1(BASE)
NetC71_2: C71.2 R17.1 R19.2 U26.4(IN-)
NetC72_1: C72.1 R20.2 R21.1 U26.3(IN+)
NetR1_1: R1.1 U1.1(~SD)
NetR2_1: R2.1 VDD_1.K
NetR3_2: R3.2 R7.1 U2.5(ADJ)
NetR4_2: R4.2 R8.1 U3.5(ADJ)
NetR5_2: R5.2 R9.1 U5.5(ADJ)
NetR6_2: R6.2 R10.1 U6.5(ADJ)

Not connected (* = marked no-connect by the designer): J21 1 21; J22 22; U7 1(DNC) 3(TEMP) 5(TRIM/NR) 7(NC) 8(DNC); U8 26(2A8); U9 5(NIC) 6(NIC) 15(NIC) 16(NIC) 17(NIC); U10 2(VOUTD) 5(NIC) 6(NIC) 15(NIC) 16(NIC) 17(NIC); U17 2(VOUTD) 5(NIC) 6(NIC) 15(NIC) 16(NIC) 17(NIC); U22 26(2A8) 27(2A7) 29(2A6) 30(2A5) 32(2A4); U27 1(NC) 5(NC) 8(NC)

## Notes on the sheet
- (in symbol C3216X5R1A686M160AC) +
- (in symbol C4532X7R1C336M250KC) +

## Library data of the parts
C1 C2 = PANACAP-100UF-16V-FK: GENERIC CAPACITOR POLARISED; Supplier 1: Digi-Key; Supplier Part Number 1: PCE3783TR-ND
C3-C5 C7-C14 = C3216X5R1A686M160AC: No Description Available; Mfr_Name: TDK; Type: DEV; Copyright: Copyright (C) 2022 Ultra Librarian. All rights reserved.; Manufacturer_Part_Number: C3216X5R1A686M160AC; RefDes: RefDes
C6 = C4532X7R1C336M250KC: No Description Available; Mfr_Name: TDK; Type: DEV; Copyright: Copyright (C) 2022 Ultra Librarian. All rights reserved.; Manufacturer_Part_Number: C4532X7R1C336M250KC; RefDes: RefDes
C15 C17 C19 C21 C23 C24 C26 C28 C31 C32 C34 C37 C39 C42 C44 C46 C47 C50 C52 C54 C56 C59 C61 C64 C66 C67 C73 = CAPC_100n_0603: Capacitor SMD Cer 100nF 10% 50V X7R 0603; Manufacturer 1: AVX Corporation; Manufacturer Part Number 1: 06035C104KAT2A; Ratings: 50V; X7R; Material: ceramic; Manufacturer 2: TDK Corporation; Manufacturer Part Number 2: C1608X7R1H104K; Package / Case: 0603 (1608 Metric); Tolerance: ±10%; Supplier 1: Digi-Key; Supplier Part Number 1: 478-5052-1-ND; ComponentLink1URL: http://www.avx.com/docs/Catalogs/cx7r.pdf; ComponentLink1Description: http://www.avx.com/docs/Catalogs/cx7r.pdf; Supplier 2: Digi-Key; Supplier Part Number 2: 445-1314-1-ND; ComponentLink2URL: http://product.tdk.com/capacitor/mlcc/en/documents/mlcc_commercial_general_en.pdf; ComponentLink2Description: http://product.tdk.com/capacitor/mlcc/en/documents/mlcc_commercial_general_en.pdf
C16 C18 C20 C22 C25 C27 C29 C33 C35 C38 C40 C43 C45 C48 C51 C53 C55 C57 C60 C62 C65 C68 C69 C72 C74 = CAPT_10u_0805_10V: Capacitor SMD Tantalum 10uF 20% 10V 0805; Manufacturer 1: AVX Corporation; Manufacturer Part Number 1: TAJP106M010RNJ; Package / Case: 0805 (2012 metric); Tolerance: ±20%; Material: Tantalum; Supplier 1: Digi-Key; Supplier Part Number 1: 478-3281-1-ND; Value: 10µ
C30 C36 C41 C49 C58 C63 = CAPC_47p_0603: Capacitor SMD Cer 47pF 0603; Ratings: 50V; NP0; Operating Temperature: -55°C ~ 125°C; Package / Case: 0603 (1608 Metric); Size / Dimension: 0.063" L x 0.031" W (1.60mm x 0.80mm); Thickness (Max): 0.037" (0.95mm); ComponentLink1URL: http://www.avx.com/docs/Catalogs/ccog.pdf; ComponentLink1Description: http://www.avx.com/docs/Catalogs/ccog.pdf; ComponentLink2URL: http://www.tdk.com/pdf/tight_tol_B11.pdf; ComponentLink2Description: http://www.tdk.com/pdf/tight_tol_B11.pdf; ComponentLink3URL: http://www.kemet.com/datasheets&C0603C221F5GACTU; ComponentLink3Description: http://www.kemet.com/datasheets&C0603C221F5GACTU; Value: 47p
C70 C71 = ML03V10R1AAT2A: No Description Available; Mfr_Name: KYOCERA AVX; Type: DEV; Copyright: Copyright (C) 2022 Ultra Librarian. All rights reserved.; Manufacturer_Part_Number: ML03V10R1AAT2A; RefDes: RefDes
J1 J2 = FCR7350R: No Description Available; Mfr_Name: Cliff; Copyright: Copyright (C) 2022 Ultra Librarian. All rights reserved.; Manufacturer_Part_Number: FCR7350R; RefDes: RefDes; Type: DEV
J3 = 39299044: No Description Available; Mfr_Name: Molex Connector Corporation; Copyright: Copyright (C) 2022 Ultra Librarian. All rights reserved.; Manufacturer_Part_Number: 39299044; RefDes: RefDes; Type: DEV
J4-J8 J17 J19 J23 J25 J28 J30 J32 J33 = 901200761: No Description Available; Mfr_Name: Molex Connector Corporation; Copyright: Copyright (C) 2022 Ultra Librarian. All rights reserved.; Manufacturer_Part_Number: 901200761; RefDes: RefDes; Type: DEV
J9-J11 J31 = 901310765: No Description Available; Mfr_Name: Molex Connector Corporation; Copyright: Copyright (C) 2022 Ultra Librarian. All rights reserved.; Manufacturer_Part_Number: 901310765; RefDes: RefDes; Type: DEV
J12 J13 J15 J16 = 142-0701-301: No Description Available; Mfr_Name: Cinch Connectivity Solutions; Copyright: Copyright (C) 2022 Ultra Librarian. All rights reserved.; Manufacturer_Part_Number: 142-0701-301; RefDes: RefDes; Type: DEV
J14 J20 J26 = 825433-4: No Description Available; Mfr_Name: TE Connectivity; Copyright: Copyright (C) 2022 Ultra Librarian. All rights reserved.; Manufacturer_Part_Number: 825433-4; RefDes: RefDes; Type: DEV
J18 J24 = SSW-115-01-T-D: No Description Available; Mfr_Name: Samtec Inc; Copyright: Copyright (C) 2022 Ultra Librarian. All rights reserved.; Manufacturer_Part_Number: SSW-115-01-T-D; RefDes: RefDes; Type: DEV
J21 J22 = SSW-111-01-G-D: No Description Available; Mfr_Name: Samtec Inc; Copyright: Copyright (C) 2022 Ultra Librarian. All rights reserved.; Manufacturer_Part_Number: SSW-111-01-G-D; RefDes: RefDes; Type: DEV
J27 = 61301221021: No Description Available; Mfr_Name: Wurth Electronics; Copyright: Copyright (C) 2022 Ultra Librarian. All rights reserved.; Manufacturer_Part_Number: 61301221021; RefDes: RefDes; Type: DEV
J29 = TSW-111-08-G-D-RA: No Description Available; Mfr_Name: Samtec Inc; Copyright: Copyright (C) 2022 Ultra Librarian. All rights reserved.; Manufacturer_Part_Number: TSW-111-08-G-D-RA; RefDes: RefDes; Type: DEV
L1 = MCSDRB7032-102MHF: 1mH 150mA inductor
R1 R7-R10 = RES_10K_0603_1%: Resistor SMD chip 10k Ohm 0.1W 1% 0603; Manufacturer 1: Yageo; Manufacturer Part Number 1: RC0603FR-0710KL; Ratings: 1/10W; Package / Case: 0603 (1608 Metric); Supplier 1: Digi-Key; Supplier Part Number 1: 311-10.0KHRCT-ND
R2 = RES_866R_0603_1%_1: Resistor SMD chip 866 Ohm 0.1W 1% 0603; Ratings: 1/10W; Package / Case: 0603 (1608 Metric)
R3-R5 = RC0603FR-073K32L: No Description Available; Mfr_Name: Yageo; Copyright: Copyright (C) 2022 Ultra Librarian. All rights reserved.; Manufacturer_Part_Number: RC0603FR-073K32L; RefDes: RefDes; Type: DEV
R6 = RC0603FR-0714KL: No Description Available; Mfr_Name: Yageo; Copyright: Copyright (C) 2022 Ultra Librarian. All rights reserved.; Manufacturer_Part_Number: RC0603FR-0714KL; RefDes: RefDes; Type: DEV
R11-R16 = RES_2K21_0603_1%: Resistor SMD chip 2.21k Ohm 0.1W 1% 0603; Ratings: 1/10W; Package / Case: 0603 (1608 Metric)
R17 = RH73X2A50GNTN: No Description Available; Mfr_Name: TE Connectivity; Copyright: Copyright (C) 2022 Ultra Librarian. All rights reserved.; Manufacturer_Part_Number: RH73X2A50GNTN; RefDes: RefDes; Type: DEV
R18 = CRCW08054M12FKEA: No Description Available; Mfr_Name: Vishay; Copyright: Copyright (C) 2022 Ultra Librarian. All rights reserved.; Manufacturer_Part_Number: CRCW08054M12FKEA; RefDes: RefDes; Type: DEV
R19 = RC0603JR-07100RL: No Description Available; Mfr_Name: Yageo; Copyright: Copyright (C) 2022 Ultra Librarian. All rights reserved.; Manufacturer_Part_Number: RC0603JR-07100RL; RefDes: RefDes; Type: DEV
R20 R21 = RES_100K_0603_1%: Resistor SMD chip 100k Ohm 0.1W 1% 0603; Manufacturer 1: Vishay/Dale; Manufacturer Part Number 1: CRCW0603100KFKEA; Ratings: 1/10W; Package / Case: 0603 (2012 metric); Supplier 1: Digi-Key; Supplier Part Number 1: 541-100KHCT-ND
U1 = LP3961ES-2.5: No Description Available; Mfr_Name: Texas Instruments; Copyright: Copyright (C) 2022 Ultra Librarian. All rights reserved.; Manufacturer_Part_Number: LP3961ES-2.5; RefDes: RefDes; Type: DEV
U2 U3 U5 U6 = BD00C0AWHFP-CTR: No Description Available; Mfr_Name: ROHM Semiconductor; Copyright: Copyright (C) 2022 Ultra Librarian. All rights reserved.; Manufacturer_Part_Number: BD00C0AWHFP-CTR; RefDes: RefDes; Type: DEV
U4 = BD33C0AFP-CE2: No Description Available; Mfr_Name: ROHM Semiconductor; Copyright: Copyright (C) 2022 Ultra Librarian. All rights reserved.; Manufacturer_Part_Number: BD33C0AFP-CE2; RefDes: RefDes; Type: DEV
U7 = REF5025AIDG4: No Description Available; Mfr_Name: Texas Instruments; Copyright: Copyright (C) 2021 Ultra Librarian. All rights reserved.; Manufacturer_Part_Number: REF5025AIDG4; RefDes: RefDes; Type: DEV
U8 U22 = SN74LVCH16T245DGGR: No Description Available; Mfr_Name: Texas Instruments; Copyright: Copyright (C) 2022 Ultra Librarian. All rights reserved.; Manufacturer_Part_Number: SN74LVCH16T245DGGR; RefDes: RefDes; Type: DEV
U9 U10 U17 = DAC7614EB: No Description Available; Mfr_Name: Texas Instruments; Copyright: Copyright (C) 2022 Ultra Librarian. All rights reserved.; Manufacturer_Part_Number: DAC7614EB; RefDes: RefDes; Type: DEV
U11 U13 U15 U18 U20 U23 U26 = TLV2771CDBVR: No Description Available; Mfr_Name: Texas Instruments; Copyright: Copyright (C) 2022 Ultra Librarian. All rights reserved.; Manufacturer_Part_Number: TLV2771CDBVR; RefDes: RefDes; Type: DEV
U12 U14 U16 U19 U21 U24 = BC817W: No Description Available; Mfr_Name: Nexperia; Copyright: Copyright (C) 2022 Ultra Librarian. All rights reserved.; Manufacturer_Part_Number: BC817W; RefDes: RefDes; Type: DEV
U25 = ADS8344E: No Description Available; Mfr_Name: Texas Instruments; Copyright: Copyright (C) 2022 Ultra Librarian. All rights reserved.; Manufacturer_Part_Number: ADS8344E; RefDes: RefDes; Type: DEV
U27 = OPA380AIDGKT: No Description Available; Mfr_Name: Texas Instruments; Copyright: Copyright (C) 2022 Ultra Librarian. All rights reserved.; Manufacturer_Part_Number: OPA380AIDGKT; RefDes: RefDes; Type: DEV
VDD_1 = LED_SMD_Red_0603_220mcd: LED 0603 SMD Hyper Red 630nm 220mcd 20mA; Manufacturer 1: Kingbright Corp; Manufacturer Part Number 1: APT1608SURCK; Ratings: 220 mcd; 630 nm; Voltage - Forward (Vf) Typ: 1.95V; Voltage - Forward (Vf) @ 10mA: 1.9V; Package / Case: 0603 (1608 metric); Material: AlGaInP on GaAs; Supplier 1: Digi-Key; Supplier Part Number 1: 754-1123-1-ND